# Altium schematic sheet Connectors.SchDoc
size A4; SheetNumber: 4; SheetTotal: 7
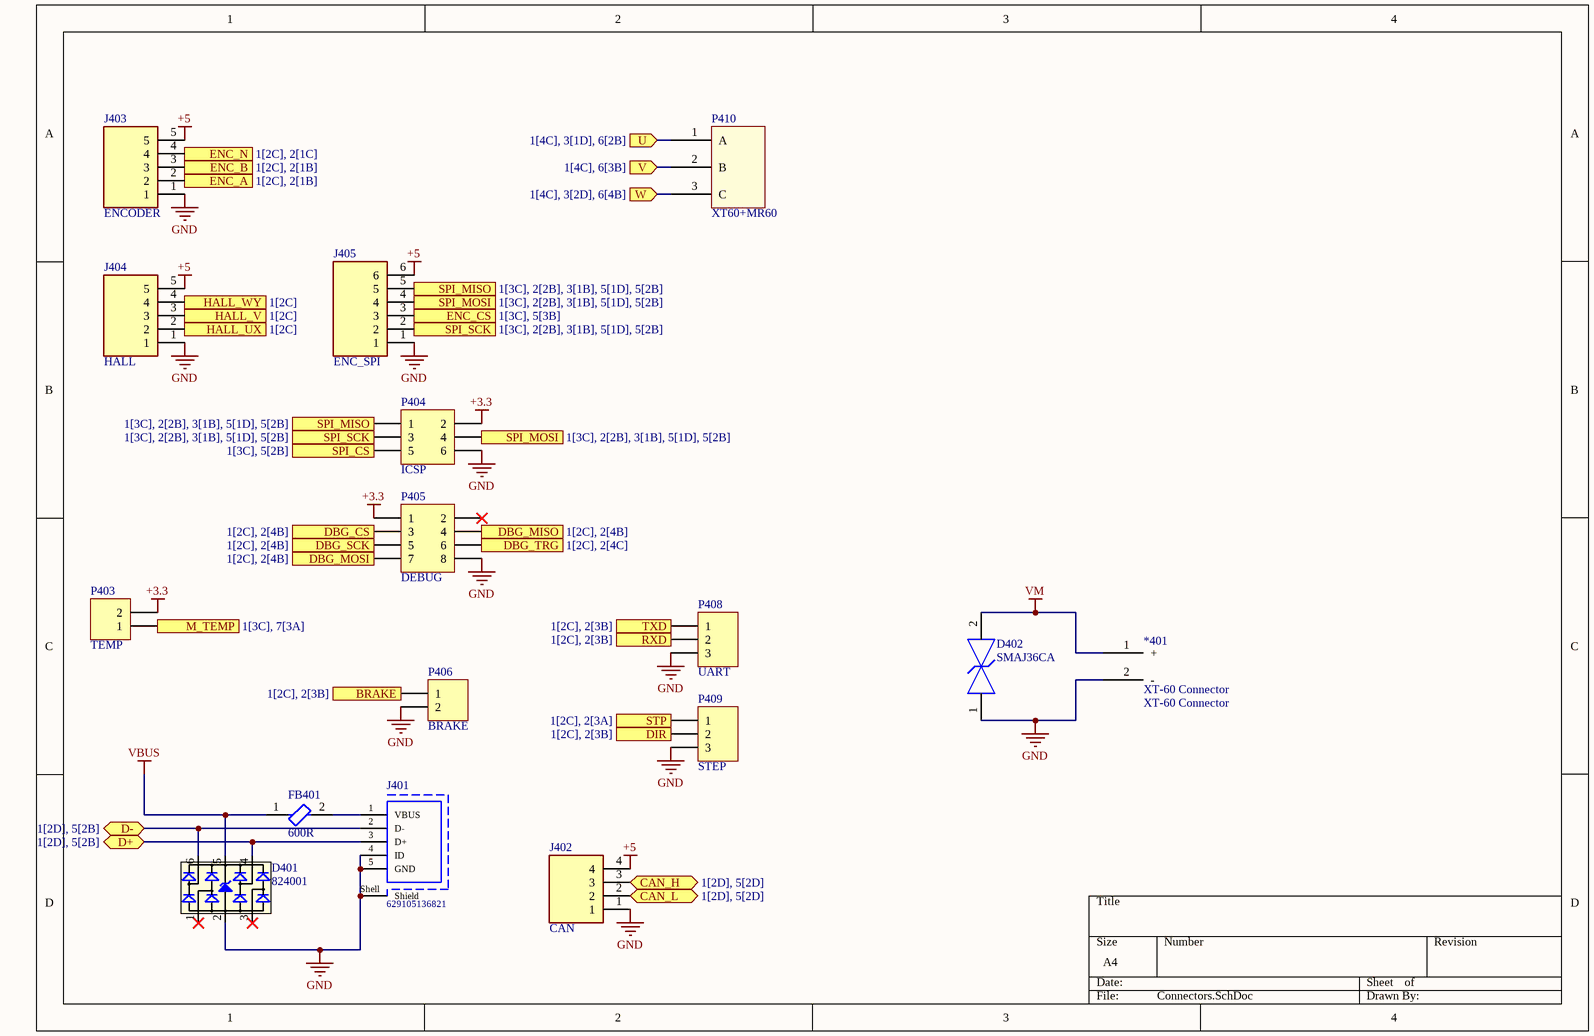
[diagram p0: Connectors.SchDoc]

## Parts
*401  XT-60 Connector  [XT-60]
D401  824001  [SOT23_6L]
D402  SMAJ36CA  [FP-SMAJ-CA-MFG]
FB401  600R  [FP-742792651-MFG]
J401  629105136821  [629105136821]
J402  CAN  [SHDRRA4W60P0X250_1X4_1170X750X510P]
J403  ENCODER  [PTSM5]
J404  HALL  [PTSM5]
J405  ENC_SPI  [PTSM6]
P403  TEMP  [HDR1X2]
P404  ICSP  [HDR2X3]
P405  DEBUG  [HDR2X4]
P406  BRAKE  [HDR1X2]
P408  UART  [HDR1X3]
P409  STEP  [HDR1X3]
P410  XT60+MR60  [XT60+MR60]

## Ports
BRAKE (in, see 1[2C], 2[3B]), CAN_H (bidir, see 1[2D], 5[2D]), CAN_L (bidir, see 1[2D], 5[2D]), D+ (bidir, see 1[2D], 5[2B]), D- (bidir, see 1[2D], 5[2B]), DBG_CS (in, see 1[2C], 2[4B]), DBG_MISO (out, see 1[2C], 2[4B]), DBG_MOSI (in, see 1[2C], 2[4B]), DBG_SCK (in, see 1[2C], 2[4B]), DBG_TRG (in, see 1[2C], 2[4C]), DIR (out, see 1[2C], 2[3B]), ENC_A (out, see 1[2C], 2[1B]), ENC_B (out, see 1[2C], 2[1B]), ENC_CS (in, see 1[3C], 5[3B]), ENC_N (out, see 1[2C], 2[1C]), HALL_UX (out, see 1[2C]), HALL_V (out, see 1[2C]), HALL_WY (out, see 1[2C]), M_TEMP (out, see 1[3C], 7[3A]), RXD (out, see 1[2C], 2[3B]), SPI_CS (out, see 1[3C], 5[2B]), SPI_MISO (out, see 1[3C], 2[2B], 3[1B], 5[1D], 5[2B]), SPI_MOSI (in, see 1[3C], 2[2B], 3[1B], 5[1D], 5[2B]), SPI_SCK (in, see 1[3C], 2[2B], 3[1B], 5[1D], 5[2B]), SPI_SCK (out, see 1[3C], 2[2B], 3[1B], 5[1D], 5[2B]), STP (out, see 1[2C], 2[3A]), TXD (in, see 1[2C], 2[3B]), U (in, see 1[4C], 3[1D], 6[2B]), V (in, see 1[4C], 6[3B]), W (in, see 1[4C], 3[2D], 6[4B])

## Nets
+3.3: P403.2 P404.2 P405.1
+5: J402.4 J403.5 J404.5 J405.6
GND: *401.2(-) D401.2(GND) D402.1 J401.4(ID) J401.5(GND) J401.Shell(Shield) J402.1 J403.1 J404.1 J405.1 P404.6 P405.8 P406.2 P408.3 P409.3
VBUS: D401.5(VDD) FB401.1
VM: *401.1(+) D402.2
BRAKE: P406.1 ; port BRAKE
CAN_H: J402.3 ; port CAN_H
CAN_L: J402.2 ; port CAN_L
D+: D401.4(I/O3) J401.3(D+) ; port D+
D-: D401.6(I/O4) J401.2(D-) ; port D-
DBG_CS: P405.3 ; port DBG_CS
DBG_MISO: P405.4 ; port DBG_MISO
DBG_MOSI: P405.7 ; port DBG_MOSI
DBG_SCK: P405.5 ; port DBG_SCK
DBG_TRG: P405.6 ; port DBG_TRG
DIR: P409.2 ; port DIR
ENC_A: J403.2 ; port ENC_A
ENC_B: J403.3 ; port ENC_B
ENC_CS: J405.3 ; port ENC_CS
ENC_N: J403.4 ; port ENC_N
HALL_UX: J404.2 ; port HALL_UX
HALL_V: J404.3 ; port HALL_V
HALL_WY: J404.4 ; port HALL_WY
M_TEMP: P403.1 ; port M_TEMP
RXD: P408.2 ; port RXD
SPI_CS: P404.5 ; port SPI_CS
SPI_MISO: J405.5 P404.1 ; port SPI_MISO
SPI_MOSI: J405.4 P404.4 ; port SPI_MOSI
SPI_SCK: J405.2 P404.3 ; port SPI_SCK
STP: P409.1 ; port STP
TXD: P408.1 ; port TXD
U: P410.1(A) ; port U
V: P410.2(B) ; port V
W: P410.3(C) ; port W
NetFB401_2: FB401.2 J401.1(VBUS)

Not connected (* = marked no-connect by the designer): D401 1(I/O1)* 3(I/O2)*; P405 2*

## Library data of the parts
*401 = XT-60 Connector: Manufacturer: POLOLU; Manufacturer Part Number: XT60 YELLOW; Unit: pcs; SuppliedAmount: 0; MinAmount: 1; Type of robotics accessories: power connector; Maximum current: 65A; Information: Product is not a working device, but only component; Supplier 1: TME; Category: Power Supply Modules; Stock 1: 29; Pricing 1: 1=2.08, 10=1.95 (USD); Weight: 7.267; Multiples: 1; Number of pins: 2; Colour: yellow; Price Type: NET; ComponentLink1URL: http://static.tme.eu/products_pics/8/b/5/8b5040a8a5baf3e0e67386c2e3a9b903/913.jpg; ComponentLink1Description: http://static.tme.eu/products_pics/8/b/5/8b5040a8a5baf3e0e67386c2e3a9b903/913.jpg; Supplier Part Number 1: XT-60 Connector
D401 = CMP-1486-00005-1: TVS Diode WE-TVS-HS, VRWM=5V; Manufacturer: Wuerth Elektronik; Reverse Stand Off Voltage: 5V; ComponentLink2Description: Datasheet; ComponentLink1URL: http://www.we-online.com; ComponentLink2URL: http://katalog.we-online.de/kataloge/eisos/media/pdf/824001.pdf; ComponentLink1Description: Manufacturer URL; PartNumber: 824001; PackageReference: SOT23_6L
D402 = CMP-08607-000009-1: TVS DIODE 36V 58.1V DO214AC; Manufacturer: Littelfuse Inc; Peak Pulse Power: 400W; Max Junction Temp: +150°C; Direction: Bidirectional; Peak Pulse Current: 6.9A; Number Of Channels: 1; Breakdown Voltage: 40V; Lead Free: Yes; Automotive: No; Device Class L1: Circuit Protection; Digikey Description: TVS DIODE 36V 58.1V DO214AC; Package: SMAJ-CA; Manufacturer Part Number: SMAJ36CA; Mouser Description: In a Pack of 25, Littelfuse SMAJ36CA, Bi-Directional TVS Diode, 400W, 2-Pin DO-214AC; Reverse Standoff Voltage: 36V; Temperature: -65°C to +150°C; Clamping Voltage: 58.1V; Height: 2.29mm; Temperature Range High: +150°C; RoHS: TRUE; Category: Diode; ComponentLink2Description: Datasheet; Device Class L2: TVS Diodes; ComponentLink2URL: https://www.littelfuse.com/~/media/electronics/datasheets/tvs_diodes/littelfuse_tvs_diode_smaj_datasheet.pdf.pdf; Octopart: https://octopart.com/smaj36ca-littelfuse-350098; Device Class L3: unset; Temperature Range Low: -65°C
FB401 = CMP-0220-00181-2: FERRITE BEAD 600 OHM 0603 1LN; Tolerance: 25%; DC Resistance (DCR): 200mR; Inductance: 0.36H; Current Rating: 1A; Test Frequency: 100MHz; Number of Lines: 1; Length: 1.6mm; Termination: SMD/SMT; Case Code (Metric): 1608; Case/Package: SMD/SMT; Min Operating Temperature: -55°C; Resistance: 200mR; Height: 0.8mm; Width: 0.8mm; Max Operating Temperature: 125°C; Package Quantity: 1; Mount: Surface Mount; Max DC Current: 1A; Max Current Rating: 1A; Weight: 0.000141oz; Packaging: Tape and Reel; Lead Free: Lead Free; Case Code (Imperial): 0603; Series: WE-CBF; Impedance: 600R; Core Material: Ferrite; Material: Ferrite; RoHS Compliant: Yes; Depth: 0.8mm
J401 = CMP-1502-03253-1: Micro USB 2.0 Type B Receptacle WR-COM, Horizontal, SMT, with Pads and Pegs; Manufacturer: Wurth Elektronik; Contact Resistance: 30mOhm; Rated Current: 1A; Working Voltage: 30VAC; Datasheet URL: https://katalog.we-online.de/em/datasheet/629105136821.pdf; Mounting Technology: SMT; Publisher: WurthElektronik; Package Reference: 629105136821; Orientation: Horizontal; Packaging: TapeandReel; Part Number: 629105136821; Manufacturer URL: http://www.we-online.de; Connector Type: MicroUSB2.0TypeB; Gender: Receptacle; Operating Temperature: -40to105degC
J402 = 1778641: PCB header, nominal cross section: 0.5 mm?, color: black, nominal current: 6 A, rated voltage (III/2): 160 V, contact surface: Tin, type of contact: Male connector, Number of potentials: 4, Number of rows: 1, Number of positions per row: 4, number of connections: 4, product range: PTSM 0,5/..-HH-THR, pitch: 2.5 mm, mounting: THR soldering, pin layout: Linear pinning, solder pin [P]: 2.1 mm, Stecksystem: COMBICON COMPACT PTSM, Locking: without, type of packaging: 32 mm wide tape; Manufacturer_Name: Phoenix Contact; Geometry.Height: 5.1mm; Manufacturer_Part_Number: 1778641; Mouser Part Number: 651-1778641; Mouser Price/Stock: https://www.mouser.co.uk/ProductDetail/Phoenix-Contact/1778641?qs=i0qWf6NAoDs%252BwkQoFV1ycQ%3D%3D; Arrow Part Number: 1778641; Arrow Price/Stock: https://www.arrow.com/en/products/1778641/phoenix-contact?region=nac; Datasheet Link: http://www.phoenixcontact.com/de/produkte/1778641/pdf
J403 J404 = 1778586: PCB header, nominal cross section: 0.5 mm?, color: black, nominal current: 6 A, rated voltage (III/2): 160 V, contact surface: Tin, type of contact: Male connector, Number of potentials: 6, Number of rows: 1, Number of positions per row: 6, number of connections: 6, product range: PTSM 0,5/..-HH-THR, pitch: 2.5 mm, mounting: THR soldering, pin layout: Linear pinning, solder pin [P]: 2.1 mm, Stecksystem: COMBICON COMPACT PTSM, Locking: without, type of packaging: 32 mm wide tape
J405 = 1778599: PCB header, nominal cross section: 0.5 mm?, color: black, nominal current: 6 A, rated voltage (III/2): 160 V, contact surface: Tin, type of contact: Male connector, Number of potentials: 5, Number of rows: 1, Number of positions per row: 5, number of connections: 5, product range: PTSM 0,5/..-HH-THR, pitch: 2.5 mm, mounting: THR soldering, pin layout: Linear pinning, solder pin [P]: 2.1 mm, Stecksystem: COMBICON COMPACT PTSM, Locking: without, type of packaging: 32 mm wide tape
P403 P406 = Header 2: Header, 2-Pin; LatestRevisionDate: 17-Jul-2002; LatestRevisionNote: Re-released for DXP Platform.; Publisher: Altium Limited
P404 = Header 3X2: Header, 3-Pin, Dual row; LatestRevisionDate: 17-Jul-2002; LatestRevisionNote: Re-released for DXP Platform.; Publisher: Altium Limited
P405 = Header 4X2: Header, 4-Pin, Dual row; LatestRevisionDate: 17-Jul-2002; LatestRevisionNote: Re-released for DXP Platform.; Publisher: Altium Limited
P408 P409 = Header 3: Header, 3-Pin; LatestRevisionDate: 17-Jul-2002; LatestRevisionNote: Re-released for DXP Platform.; Publisher: Altium Limited